# Altium project MOS双电机驱动.PrjPcb
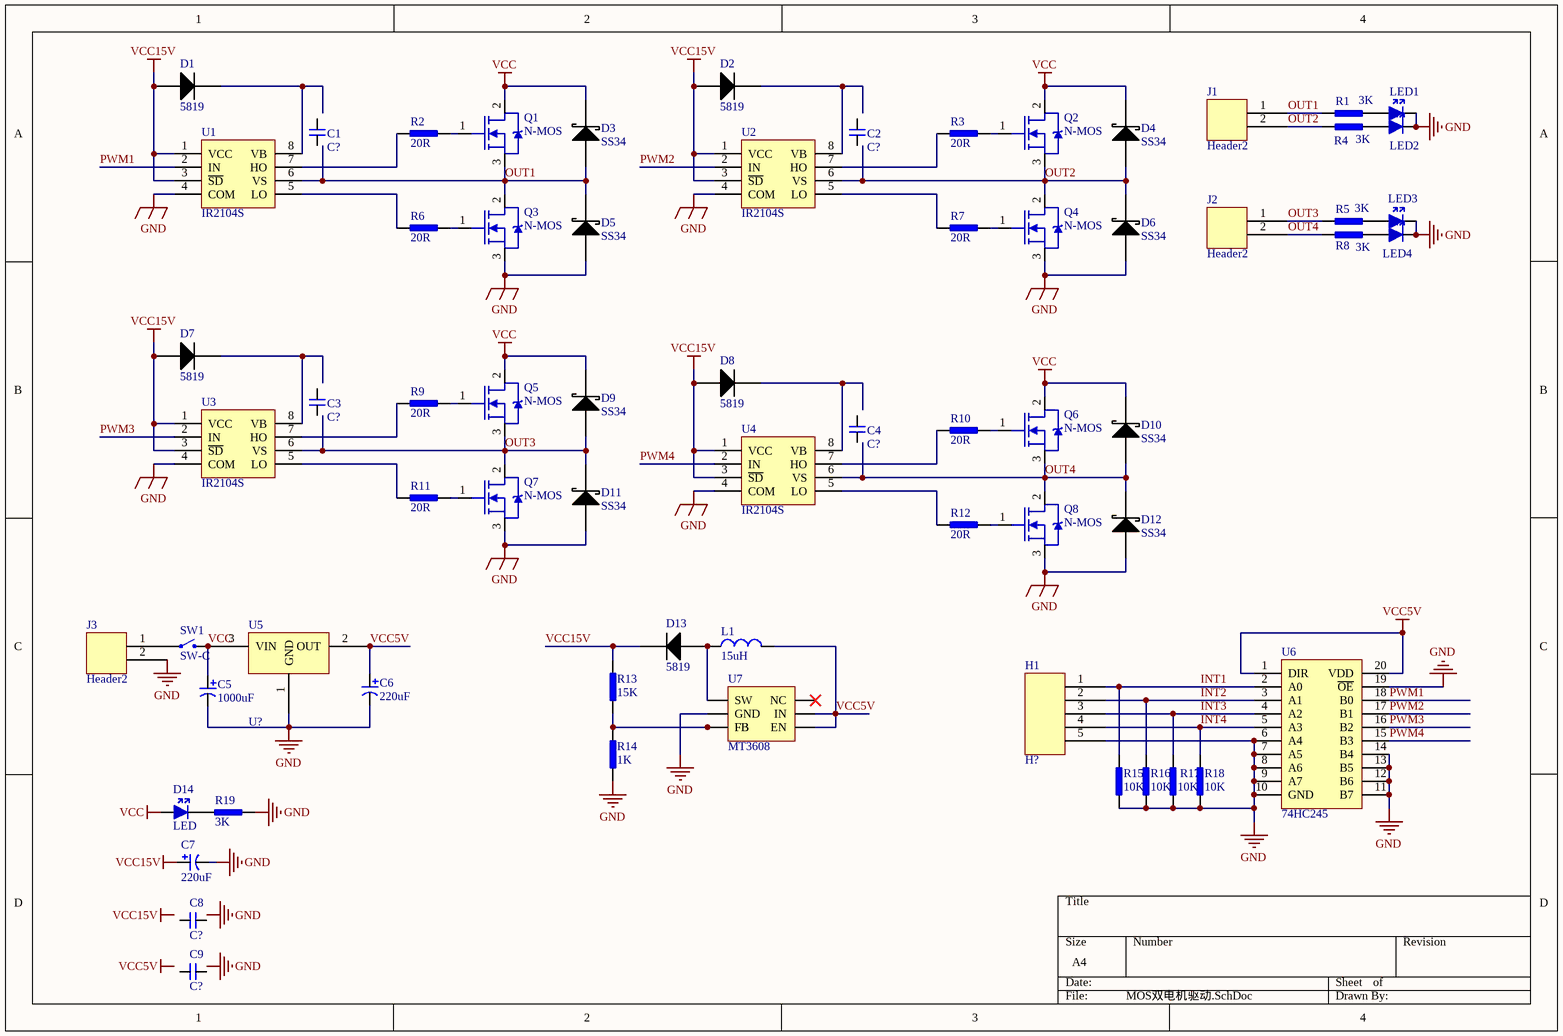
[diagram p0: MOS双电机驱动.SchDoc]
1 sheet, 67 parts. Net scope: global (net labels, ports and power ports of the same name join across sheets).
Board file: MOS双电机驱动.PcbDoc

## Sheet MOS双电机驱动.SchDoc
size A4

### Parts
C1  C?  [C 0805]
C2  C?  [C 0805]
C3  C?  [C 0805]
C4  C?  [C 0805]
C5  1000uF  [直插电解电容10]
C6  220uF  [CAP6.6X6.6]
C7  220uF  [CAP6.6X6.6]
C8  C?  [C 0805]
C9  C?  [C 0805]
D1  5819  [D1206]
D2  5819  [D1206]
D3  SS34  [SMA]
D4  SS34  [SMA]
D5  SS34  [SMA]
D6  SS34  [SMA]
D7  5819  [D1206]
D8  5819  [D1206]
D9  SS34  [SMA]
D10  SS34  [SMA]
D11  SS34  [SMA]
D12  SS34  [SMA]
D13  5819  [D1206]
D14  LED  [0805LED]
H1  H?  [SIP05]
J1  Header2  [2PIN-5.08B]
J2  Header2  [2PIN-5.08B]
J3  Header2  [2PIN-5.08B]
L1  15uH  [L-06030]
LED1  LED  [0805LED]  (value not drawn)
LED2  LED  [0805LED]  (value not drawn)
LED3  LED  [0805LED]  (value not drawn)
LED4  LED  [0805LED]  (value not drawn)
Q1  N-MOS  [TO-252]
Q2  N-MOS  [TO-252]
Q3  N-MOS  [TO-252]
Q4  N-MOS  [TO-252]
Q5  N-MOS  [TO-252]
Q6  N-MOS  [TO-252]
Q7  N-MOS  [TO-252]
Q8  N-MOS  [TO-252]
R1  3K  [R 0805]
R2  20R  [R 0805]
R3  20R  [R 0805]
R4  3K  [R 0805]
R5  3K  [R 0805]
R6  20R  [R 0805]
R7  20R  [R 0805]
R8  3K  [R 0805]
R9  20R  [R 0805]
R10  20R  [R 0805]
R11  20R  [R 0805]
R12  20R  [R 0805]
R13  15K  [R 0805]
R14  1K  [R 0805]
R15  10K  [R 0805]
R16  10K  [R 0805]
R17  10K  [R 0805]
R18  10K  [R 0805]
R19  3K  [R 0805]
SW1  SW-C  [SW-TO3]
U1  IR2104S  [SOP-8]
U2  IR2104S  [SOP-8]
U3  IR2104S  [SOP-8]
U4  IR2104S  [SOP-8]
U5  U?  [SOT223]
U6  74HC245  [TSSOP-20]
U7  MT3608  [SOT23-6]

### Nets
GND: C5.1 C6.1 C7.1 D5.1 D6.1 D11.1 D12.1 H1.5 J3.2 LED1.2 LED2.2 LED3.2 LED4.2 Q3.3 Q4.3 Q7.3 Q8.3 R14.1 R15.1 R16.1 R17.1 R18.1 R19.2 U1.4(COM) U2.4(COM) U3.4(COM) U4.4(COM) U5.1(GND) U6.6(A4) U6.7(A5) U6.8(A6) U6.9(A7) U6.10(GND) U6.11(B7) U6.12(B6) U6.13(B5) U6.14(B4) U6.19(~{OE}) U7.2(GND)
VCC: C5.2 D3.2 D4.2 D9.2 D10.2 D14.1 Q1.2 Q2.2 Q5.2 Q6.2 SW1.2 U5.3(VIN)
VCC5V: C6.2 L1.1 U5.2(OUT) U6.1(DIR) U6.20(VDD) U7.4(EN) U7.5(IN)
VCC15V: C7.2 D1.1 D2.1 D7.1 D8.1 D13.2 R13.2 U1.1(VCC) U1.3(~{SD}) U2.1(VCC) U2.3(~{SD}) U3.1(VCC) U3.3(~{SD}) U4.1(VCC) U4.3(~{SD})
INT1: H1.1 R15.2 U6.2(A0)
INT2: H1.2 R16.2 U6.3(A1)
INT3: H1.3 R17.2 U6.4(A2)
INT4: H1.4 R18.2 U6.5(A3)
OUT1: D3.1 D5.2 J1.1 Q1.3 Q3.2 R1.1 U1.6(VS)
OUT2: D4.1 D6.2 J1.2 Q2.3 Q4.2 R4.1 U2.6(VS)
OUT3: D9.1 D11.2 J2.1 Q5.3 Q7.2 R5.1 U3.6(VS)
OUT4: D10.1 D12.2 J2.2 Q6.3 Q8.2 R8.1 U4.6(VS)
PWM1: U1.2(IN) U6.18(B0)
PWM2: U2.2(IN) U6.17(B1)
PWM3: U3.2(IN) U6.16(B2)
PWM4: U4.2(IN) U6.15(B3)
NetD1_2: D1.2 U1.8(VB)
NetD2_2: D2.2 U2.8(VB)
NetD7_2: D7.2 U3.8(VB)
NetD8_2: D8.2 U4.8(VB)
NetD13_1: D13.1 L1.2 U7.1(SW)
NetD14_2: D14.2 R19.1
NetJ3_1: J3.1 SW1.1
NetLED1_1: LED1.1 R1.2
NetLED2_1: LED2.1 R4.2
NetLED3_1: LED3.1 R5.2
NetLED4_1: LED4.1 R8.2
NetQ1_1: Q1.1 R2.2
NetQ2_1: Q2.1 R3.2
NetQ3_1: Q3.1 R6.2
NetQ4_1: Q4.1 R7.2
NetQ5_1: Q5.1 R9.2
NetQ6_1: Q6.1 R10.2
NetQ7_1: Q7.1 R11.2
NetQ8_1: Q8.1 R12.2
NetR2_1: R2.1 U1.7(HO)
NetR3_1: R3.1 U2.7(HO)
NetR6_1: R6.1 U1.5(LO)
NetR7_1: R7.1 U2.5(LO)
NetR9_1: R9.1 U3.7(HO)
NetR10_1: R10.1 U4.7(HO)
NetR11_1: R11.1 U3.5(LO)
NetR12_1: R12.1 U4.5(LO)
NetR13_1: R13.1 R14.2 U7.3(FB) U7.4(FB)

Not connected (* = marked no-connect by the designer): C1 1 2; C2 1 2; C3 1 2; C4 1 2; C8 1 2; C9 1 2; U7 6(NC)*

### Notes on the sheet
- Labels drawn without touching a wire or pin: GND, VCC5V, VCC15V

### Library data of the parts
C1-C4 C8 C9 = CAP
C5-C7 = CAP-SMD
D1 D2 D7 D8 D13 = D1206
D3-D6 D9-D12 = D-SMA: 肖特基二极管
H1 = header5
L1 = Inductance
R1-R19 = RES
U1-U4 = IR2104S: 半桥驱动器
U5 = 1117